# Altium project AttenController.PrjPcb
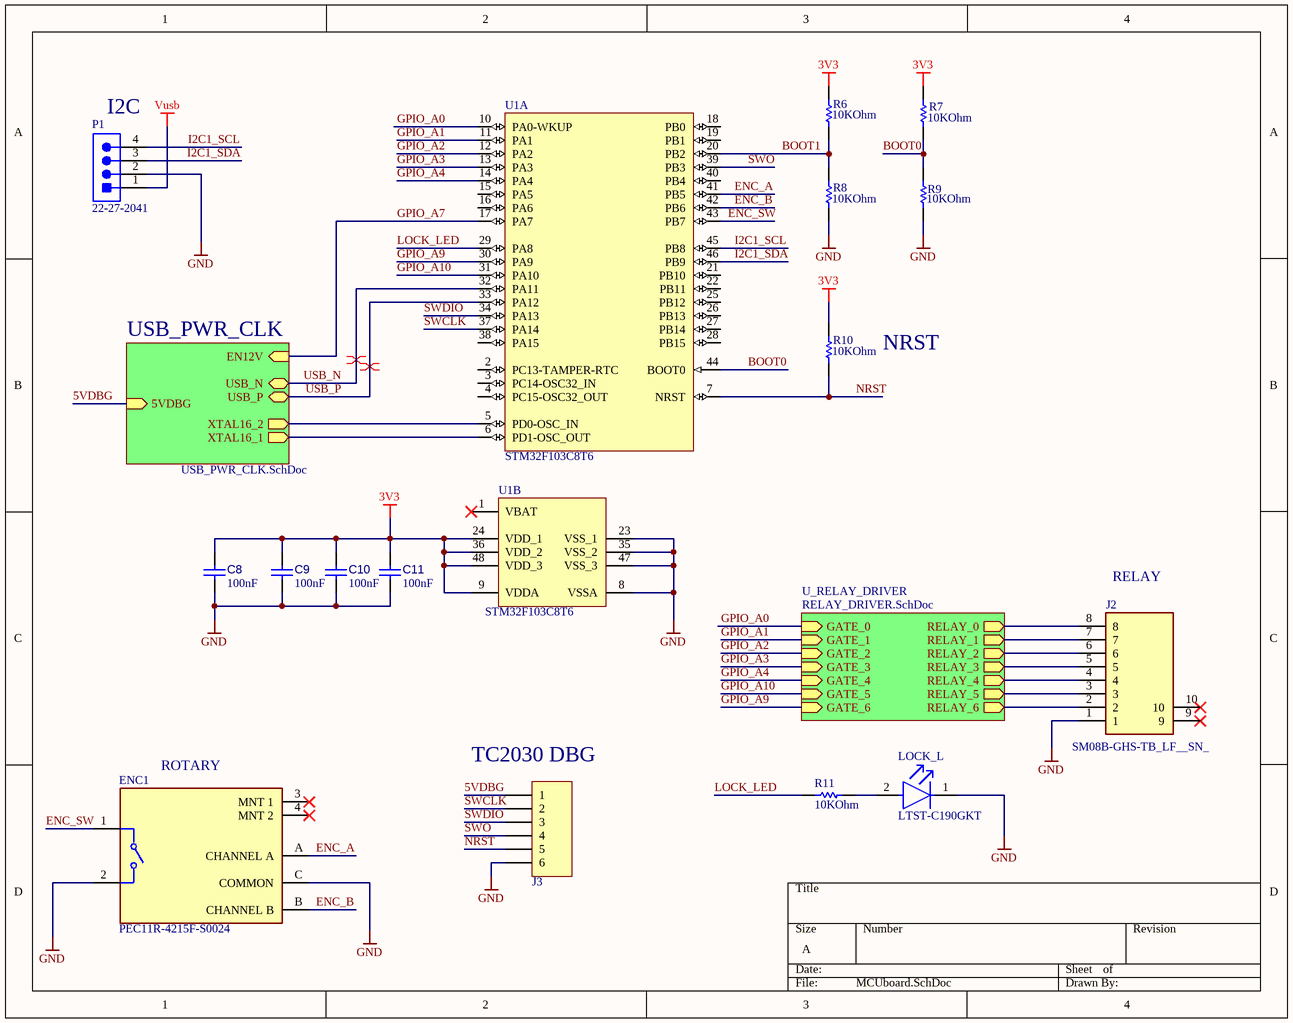
[diagram p0: MCUboard.SchDoc]
3 sheets, 63 parts. Net scope: hierarchical (ports join the sheet entries above them; power ports are global).
Board file: MCUboard.PcbDoc
Sheets:
  MCUboard.SchDoc
    USB_PWR_CLK = USB_PWR_CLK.SchDoc
    U_RELAY_DRIVER = RELAY_DRIVER.SchDoc

## Sheet MCUboard.SchDoc
size A; SheetNumber: 1; SheetTotal: 3

### Parts
C8  value 100nF  [CAPC1608X90X40NL10T20]  (hidden comment: Capacitor 100 nF +/-10% 50 V 0603)
C9  value 100nF  [CAPC1608X90X40NL10T20]  (hidden comment: Capacitor 100 nF +/-10% 50 V 0603)
C10  value 100nF  [CAPC1608X90X40NL10T20]  (hidden comment: Capacitor 100 nF +/-10% 50 V 0603)
C11  value 100nF  [CAPC1608X90X40NL10T20]  (hidden comment: Capacitor 100 nF +/-10% 50 V 0603)
ENC1  PEC11R-4215F-S0024  [FP-PEC11R-4215F-S0024-MFG]
J2  SM08B-GHS-TB_LF__SN_  [SM08BGHSTBLFSN]
J3  ICSP  [TC2030-MCP-NL]  (value not drawn)
LOCK_L  LTST-C190GKT  [FP-LTST-C190GKT-MFG]
P1  22-27-2041  [MOLX-22-27-2041_V]
R6  Resistance: 10KOhm  [RESC1609X55X30LL15T15]  (hidden comment: ERJ3EKF1002V)
R7  Resistance: 10KOhm  [RESC1609X55X30LL15T15]  (hidden comment: ERJ3EKF1002V)
R8  Resistance: 10KOhm  [RESC1609X55X30LL15T15]  (hidden comment: ERJ3EKF1002V)
R9  Resistance: 10KOhm  [RESC1609X55X30LL15T15]  (hidden comment: ERJ3EKF1002V)
R10  Resistance: 10KOhm  [RESC1609X55X30LL15T15]  (hidden comment: ERJ3EKF1002V)
R11  Resistance: 10KOhm  [RESC1609X55X30LL15T15]  (hidden comment: ERJ3EKF1002V)
U1  STM32F103C8T6  [STM-LQFP48_L]  (parts A,B of 2)

### Sub-sheets
U_RELAY_DRIVER = RELAY_DRIVER.SchDoc: GATE_0 (in), RELAY_0 (out), GATE_1 (in), RELAY_1 (out), GATE_2 (in), RELAY_2 (out), RELAY_3 (out), RELAY_4 (out), RELAY_5 (out), RELAY_6 (out), GATE_3 (in), GATE_4 (in), GATE_5 (in), GATE_6 (in)
USB_PWR_CLK = USB_PWR_CLK.SchDoc: XTAL16_2 (out), XTAL16_1 (out), USB_N (bidir), USB_P (bidir), EN12V (in), 5VDBG (in)

### Nets
3V3: C8.1 C9.1 C10.1 C11.1 R6.2 R7.2 R10.2 U1.9(VDDA) U1.24(VDD_1) U1.36(VDD_2) U1.48(VDD_3)
GND: C8.2 C9.2 C10.2 C11.2 ENC1.2 ENC1.C(COMMON) J2.1 J3.6 LOCK_L.1(C) P1.2 R8.1 R9.1 U1.8(VSSA) U1.23(VSS_1) U1.35(VSS_2) U1.47(VSS_3)
Vusb: P1.1
5VDBG: J3.1 ; sheet USB_PWR_CLK/5VDBG
BOOT0: R7.1 R9.2 U1.44(BOOT0)
BOOT1: R6.1 R8.2 U1.20(PB2)
ENC_A: ENC1.A(CHANNEL_A) U1.41(PB5)
ENC_B: ENC1.B(CHANNEL_B) U1.42(PB6)
ENC_SW: ENC1.1 U1.43(PB7)
GPIO_A0: U1.10(PA0-WKUP) ; sheet U_RELAY_DRIVER/GATE_0
GPIO_A1: U1.11(PA1) ; sheet U_RELAY_DRIVER/GATE_1
GPIO_A2: U1.12(PA2) ; sheet U_RELAY_DRIVER/GATE_2
GPIO_A3: U1.13(PA3) ; sheet U_RELAY_DRIVER/GATE_3
GPIO_A4: U1.14(PA4) ; sheet U_RELAY_DRIVER/GATE_4
GPIO_A7: U1.17(PA7) ; sheet USB_PWR_CLK/EN12V
GPIO_A9: U1.30(PA9) ; sheet U_RELAY_DRIVER/GATE_6
GPIO_A10: U1.31(PA10) ; sheet U_RELAY_DRIVER/GATE_5
I2C1_SCL: P1.4 U1.45(PB8)
I2C1_SDA: P1.3 U1.46(PB9)
LOCK_LED: R11.2 U1.29(PA8)
NRST: J3.5 R10.1 U1.7(NRST)
SWCLK: J3.2 U1.37(PA14)
SWDIO: J3.3 U1.34(PA13)
SWO: J3.4 U1.39(PB3)
USB_N: U1.32(PA11) ; sheet USB_PWR_CLK/USB_N
USB_P: U1.33(PA12) ; sheet USB_PWR_CLK/USB_P
NetC2_1: U1.5(PD0-OSC_IN) ; sheet USB_PWR_CLK/XTAL16_2
NetC3_1: U1.6(PD1-OSC_OUT) ; sheet USB_PWR_CLK/XTAL16_1
NetD2_2: J2.8 ; sheet U_RELAY_DRIVER/RELAY_0
NetD3_2: J2.7 ; sheet U_RELAY_DRIVER/RELAY_1
NetD4_2: J2.6 ; sheet U_RELAY_DRIVER/RELAY_2
NetD5_2: J2.5 ; sheet U_RELAY_DRIVER/RELAY_3
NetD6_2: J2.4 ; sheet U_RELAY_DRIVER/RELAY_4
NetD7_2: J2.3 ; sheet U_RELAY_DRIVER/RELAY_5
NetD8_2: J2.2 ; sheet U_RELAY_DRIVER/RELAY_6
NetLOCK_L_2: LOCK_L.2(A) R11.1

Not connected (* = marked no-connect by the designer): ENC1 3(MNT_1)* 4(MNT_2)*; J2 9* 10*; U1 1(VBAT)* 2(PC13-TAMPER-RTC) 3(PC14-OSC32_IN) 4(PC15-OSC32_OUT) 15(PA5) 16(PA6) 18(PB0) 19(PB1) 21(PB10) 22(PB11) 25(PB12) 26(PB13) 27(PB14) 28(PB15) 38(PA15) 40(PB4)

### Layout directives
differential pair; differential pair class USB: USB_N, USB_P

### Notes on the sheet
- (near P1) I2C
- NRST
- (near J2) RELAY
- (near ENC1) ROTARY
- (near J3) TC2030 DBG

### Library data of the parts
C8-C11 = CMP-001-00017-7: Chip Capacitor, 100 nF, +/- 10%, 50 V, 0603 (1608 Metric); Voltage Rating: 50V; Capacitor Type: Ceramic; Tolerance: 10%; Mounting Technology: SM; Max Operating Temperature: 125°C; RoHS Compliant: True; Pins: 2; Case/Package: 0603; Min Operating Temperature: -55°C
ENC1 = CMP-1747-00012-2: ROTARY ENCODER MECHANICAL 24PPR; Hole Diameter: 1.8mm; Output Type: Quadrature; Pulses per Revolution: 24; Number of Channels: 2; Built in Switch: Yes; Min Operating Temperature: -30°C; Series: PEC11R; Type: Mechanical; Package Quantity: 150; Length: 21.5mm; Max Operating Temperature: 70°C; Encoder Type: Mechanical; Height: 13.4mm; Detent: Yes; Packaging: Bulk; Orientation: Vertical; Width: 12.5mm; Termination: PC Pins; Mount: Through Hole; REACH SVHC: No SVHC; Radiation Hardening: No; RoHS Compliant: Yes
J2 = SM08B-GHS-TB_LF__SN_: Connector; Manufacturer_Name: JST (JAPAN SOLDERLESS TERMINALS); Manufacturer_Part_Number: SM08B-GHS-TB(LF)(SN); Datasheet Link: http://www.jst-mfg.com/product/pdf/eng/eGH.pdf; Height: 4.05mm; Arrow Part Number: SM08B-GHS-TB(LF)(SN); Arrow Price/Stock: https://www.arrow.com/en/products/sm08b-ghs-tb-lf-sn/jst-manufacturing
J3 = CMP-008-000000-2: Design Item ID: ICSP; Component Type: Standard; Source: TC2030.SchLib; Pin Count: 5
LOCK_L = CMP-22017-000005-2: LED GREEN CLEAR CHIP SMD; Dominant Wavelength: 569nm; Reverse Voltage: 5V; Lens Color: Colorless; Viewing Angle: 130°; Voltage: 2V; Forward Current: 30mA; Power Dissipation: 100mW; Luminous Intensity: 6mcd; Number of LEDs: 1; Forward Voltage: 2.1V; Wavelength: 565nm; Test Current: 10mA; Min Operating Temperature: -55°C; Lens Style: Clear; Mount: Surface Mount; Width: 0.8mm; Packaging: Tape and Reel; Lens Transparency: Clear; Case Code (Metric): 1608; Depth: 0.8mm; Case Code (Imperial): 0603; Case/Package: 0603; Number of Pins: 2; Max Operating Temperature: 85°C; Lead Free: Lead Free; Number of Elements: 1; Length: 1.6mm; Height: 0.8mm; Package Quantity: 1; Power Rating: 100mW; Radiation Hardening: No; Illumination Color: Green; Color: Green
P1 = CMP-2000-05243-1: Male Header, Pitch 2.54 mm, 1 x 4 Position, Height 11.7 mm, Tail Length 3.56 mm, RoHS, Bulk; Manufacturer: Molex; Voltage rating: 250V; Current rating: 4A; Datasheet Version: Rev. F, 06/2009; Operating temperature: 0degCto+75degC; Contact material: Tinplatedbrass; Manufacturer URL: http://www.molex.com/; Housing material: Nylon(UL94V-0); Datasheet URL: http://www.molex.com/pdm_docs/sd/022272041_sd.pdf
R6-R11 = CMP-1012-00623-3: Chip Resistor, 10 KOhm, +/- 1%, 0.1 W, -55 to 155 degC, 0603 (1608 Metric), RoHS, Tape and Reel; Manufacturer: Panasonic; Voltage Rating: 75V; Case\/Package: 0603; Power Rating: 100mW; Temperature Coefficient: 100ppm\/degreesC; Number of Pins: 2; Package Reference: 603; Depth: 0.8mm; Mount: SurfaceMount; Package Description: 2-Pin Surface Mount Device, Body 1.6 x 0.85 mm; Datasheet Version: 02/2017; Length: 1.6mm; Lead Free: LeadFree; Height: 0.45mm; Number of Terminations: 2; Max Power Dissipation: 100mW; Min Operating Temperature: -55degC; Datasheet URL: https://industrial.panasonic.com/cdbs/www-data/pdf/RDA0000/AOA0000C304.pdf; Termination: SMD/SMT; Case Code (Metric): 1608; Case Code (Imperial): 0603; Tolerance: 1%; Max Operating Temperature: 155degC; RoHSCompliant: true; Voltage Rating (DC): 75V; Radiation Hardening: No; Packaging: TapeandReel; Composition: ThickFilm; Mounting Technology: SurfaceMount; Manufacturer URL: http://www.panasonic.com/; Width: 0.031inch; REACH SVHC: NoSVHC; Contact Plating: Tin; Military Standard: Not; Package Quantity: 1
U1 = CMP-0237-00215-3: ARM Cortex-M3 32-bit MCU, 64 KB Flash, 20 KB Internal RAM, 37 I/Os, 48-pin LQFP, -40 to 85 degC, Tray; Supply Voltage(Vcc) min (V): 2; Internal RAM Size (kB): 20; FLASH Size (Prog) (kB): 64; A/D Converter: 2x12-bit (10 Channel); I/Os (High Current): 37; Operating Frequency(F) (Processor speed) (MHz): 72; Core: ARM Cortex-M3; ComponentLink3Description: Package Specification; Mounting Technology: Surface Mount; PartNumber: STM32F103C8T6; PackageReference: LQFP48; Packing: Tray; ComponentLink3URL: http://www.st.com/st-web-ui/static/active/en/resource/technical/document/datasheet/DM00058181.pdf; DatasheetVersion: Rev. 16; ComponentLink1URL: http://www.st.com/web/en/home.html; PackageVersion: Rev. 6, 06/2013; ComponentLink2URL: http://www.st.com/st-web-ui/static/active/en/resource/technical/document/datasheet/CD00161566.pdf; ComponentLink1Description: Manufacturer URL; ComponentLink2Description: Datasheet; PackageDescription: 48-Pin Low Profile Quad Flat Package, 7 x 7 mm Body, 0.5 mm Pitch

## Sheet USB_PWR_CLK.SchDoc
size A; SheetNumber: 2; SheetTotal: 3
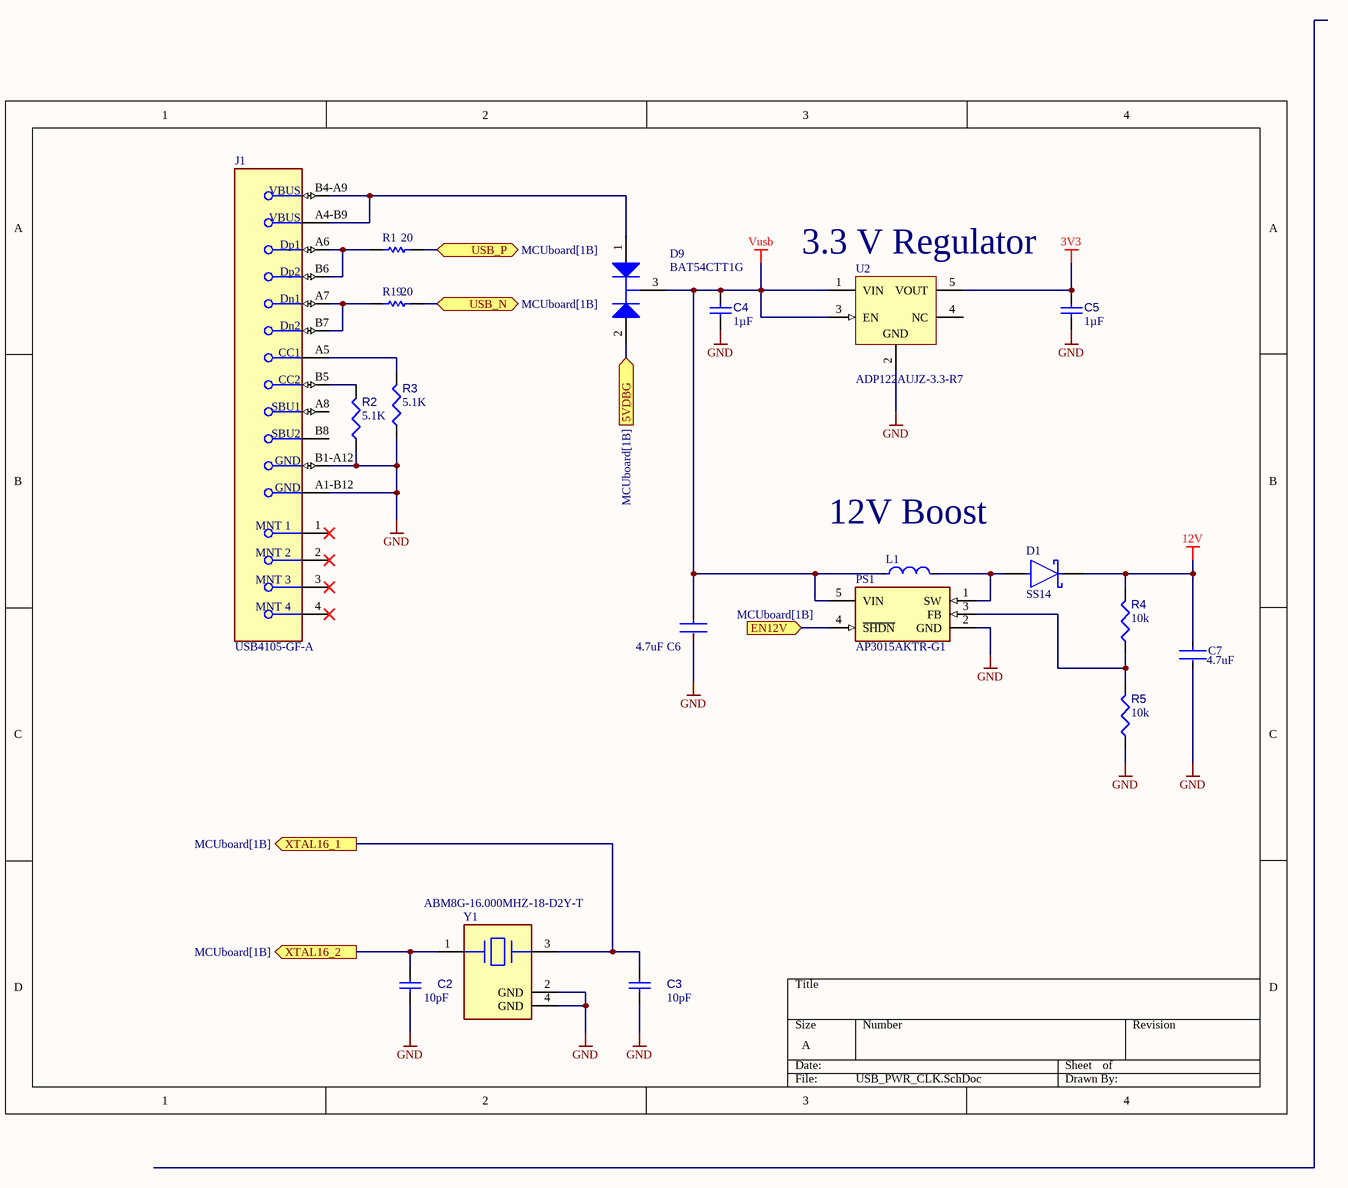
[diagram p1: USB_PWR_CLK.SchDoc]

### Parts
C2  value 10pF  [CAPC1608X87X35NL15T15]  (hidden comment: Capacitor 10 pF +/- 0.25 pF 50 V 0603)
C3  value 10pF  [CAPC1608X87X35NL15T15]  (hidden comment: Capacitor 10 pF +/- 0.25 pF 50 V 0603)
C4  value 1µF  [CAPC1608X90X35ML15T15]  (hidden comment: Capacitor 1uF +/- 10% 16V 0603)
C5  value 1µF  [CAPC1608X90X35ML15T15]  (hidden comment: Capacitor 1uF +/- 10% 16V 0603)
C6  Capacitance: 4.7uF  [FP-GRM188-0_15-IPC_C]  (hidden comment: GRM188R61E475KE11D)
C7  Capacitance: 4.7uF  [FP-GRM188-0_15-IPC_C]  (hidden comment: GRM188R61E475KE11D)
D1  SS14  [FP-403AE-MFG]
D9  BAT54CTT1G  [ONSC-SC-75-3-463-01_V]
J1  USB4105-GF-A  [FP-USB4105-GF-A-MFG]
L1  MLZ2012N100LT000  [FP-MLZ2012-1_25-MFG]  (value not drawn)
PS1  AP3015AKTR-G1  [SOT95P280X145-5N]
R1  Resistance: 20  [RESC1609X55X30LL15T15]  (hidden comment: ERJ3EKF1002V)
R2  value 5.1K  [RESC1608X55X25ML10T15]  (hidden comment: Resistor 10k +/-1% 0603 100 mW)
R3  value 5.1K  [RESC1608X55X25ML10T15]  (hidden comment: Resistor 10k +/-1% 0603 100 mW)
R4  value 10k  [RESC1608X55X25ML10T15]  (hidden comment: Resistor 10k +/-1% 0603 100 mW)
R5  value 10k  [RESC1608X55X25ML10T15]  (hidden comment: Resistor 10k +/-1% 0603 100 mW)
R19  Resistance: 20  [RESC1609X55X30LL15T15]  (hidden comment: ERJ3EKF1002V)
U2  ADP122AUJZ-3.3-R7  [ADI-UJ-5_M]
Y1  ABM8G-16.000MHZ-18-D2Y-T  [FP-ABM8G-MFG]

### Ports
5VDBG (in, see MCUboard[1B]), EN12V (in, see MCUboard[1B]), USB_N (bidir, see MCUboard[1B]), USB_P (bidir, see MCUboard[1B]), XTAL16_1 (out, see MCUboard[1B]), XTAL16_2 (out, see MCUboard[1B])

### Nets
3V3: C5.2 U2.5(VOUT)
12V: C7.1 D1.2(C) R4.2
GND: C2.2 C3.2 C4.1 C5.1 C6.2 C7.2 J1.A1-B12(GND) J1.B1-A12(GND) PS1.2(GND) R2.1 R3.1 R5.1 U2.2(GND) Y1.2(GND) Y1.4(GND)
Vusb: C4.2 C6.1 D9.3(K) L1.1 PS1.5(VIN) U2.1(VIN) U2.3(EN)
5VDBG: D9.2(A2) ; port 5VDBG
GPIO_A7: PS1.4(~{SHDN}) ; port EN12V
USB_N: R19.1 ; port USB_N
USB_P: R1.1 ; port USB_P
NetC2_1: C2.1 Y1.1 ; port XTAL16_2
NetC3_1: C3.1 Y1.3 ; port XTAL16_1
NetD1_1: D1.1(A) L1.2 PS1.1(SW)
NetD9_1: D9.1(A1) J1.A4-B9(VBUS) J1.B4-A9(VBUS)
NetJ1_A5: J1.A5(CC1) R3.2
NetJ1_A6: J1.A6(Dp1) J1.B6(Dp2) R1.2
NetJ1_A7: J1.A7(Dn1) J1.B7(Dn2) R19.2
NetJ1_B5: J1.B5(CC2) R2.2
NetPS1_3: PS1.3(FB) R4.1 R5.2

Not connected (* = marked no-connect by the designer): J1 1(MNT_1)* 2(MNT_2)* 3(MNT_3)* 4(MNT_4)* A8(SBU1) B8(SBU2); U2 4(NC)

### Notes on the sheet
- 3.3 V Regulator
- 12V Boost

### Library data of the parts
C2 C3 = CMP-001-00012-7: Chip Capacitor, 10 pF, +/- 0.25 pF, 50 V, 0603 (1608 Metric); Tolerance: 0.25%; Capacitor Type: Ceramic; Voltage Rating: 50V; Max Operating Temperature: 125°C; RoHS Compliant: True; Mounting Technology: SM; Pins: 2; Case/Package: 0603; Min Operating Temperature: -55°C
C4 C5 = CMP-001-00004-7: Chip Capacitor, 1 uF, +/- 10%, 16 V, 0603 (1608 Metric); Capacitor Type: Ceramic; Mounting Technology: SM; RoHS Compliant: True; Min Operating Temperature: -55°C; Case/Package: 0603; Pins: 2; Voltage Rating: 16V; Max Operating Temperature: 125°C; Tolerance: 10%
C6 C7 = CMP-2006-02523-2: Chip Multilayer Ceramic Capacitors for General Purpose, 0603, 4.7uF, X5R, 15%, 10%, 25V; Case Code (Metric): 1608; Max Operating Temperature: 85°C; REACH SVHC: No SVHC; Voltage Rating: 25V; Dielectric: X5R; Packaging: Cut Tape; Width: 0.031inch; Min Operating Temperature: -55°C; Lead Free: Lead Free; Height: 0.8mm; Case Code (Imperial): 0603; Length: 1.6mm; Voltage Rating (DC): 25V; Case/Package: 0603; Voltage: 25V; Tolerance: 10%; Thickness: 0.031inch; Mount: Surface Mount; Material: Ceramic; Package Quantity: 4000; Depth: 0.8mm
D1 = CMP-2000-04943-2: DIODE SCHOTTKY 40V 1A SMA; Manufacturer: ON Semiconductor; Peak Reverse Current: 0.2mA; Max Junction Temp: +125°C; Standoff Height: 0.05mm; Max Surge Forward Current: 40A; Mouser Description: Schottky Diodes & Rectifiers SMA 40V 1.0A; RoHS: TRUE; Lead Free: Yes; Manufacturer Part Number: SS14; Device Class L3: Schottky Diodes; Category: Diode; Automotive: No; Digikey Description: DIODE SCHOTTKY 40V 1A SMA; ComponentLink2Description: Datasheet; Device Class L2: Diodes; Height: 2.5mm; Temperature Range High: +125°C; ComponentLink2URL: https://www.onsemi.com/pub/Collateral/SS19-D.PDF; Device Class L1: Discrete Semiconductors; Package: 403AE; Octopart: https://octopart.com/ss14-on+semiconductor-29205033; Max Repetitive Reverse Voltage: 40V; Temperature Range Low: -65°C; Forward Current: 1A; Temperature: -65°C to +125°C
D9 = CMP-1055-00298-1: Dual Series Cathode Schottky Barrier Diodes, 3-Pin SC-75, Pb-Free, Tape and Reel; Manufacturer: On Semiconductor; trr Max (ns): 5; Configuration: Common Cathode; IFSM Max (A): 0.6; Packing: Tape and Reel; PackageReference: SC-75-3-463-01; PackageVersion: Rev. F, 07/2005; ComponentLink3URL: http://www.onsemi.com/pub_link/Collateral/463-01.PDF; ComponentLink1URL: http://www.onsemi.com/; RoHS: TRUE; ComponentLink2URL: http://www.onsemi.cn/pub_link/Collateral/BAT54CTT1-D.PDF; Mounting Technology: Surface Mount; PartNumber: BAT54CTT1G; DatasheetVersion: Rev. 4; PackageDescription: 3-Pin Small Outline Transistor, Body 1.6 x 0.8 mm, Pitch 0.5 mm; ComponentLink2Description: Datasheet; ComponentLink3Description: Package Specification; ComponentLink1Description: Manufacturer URL
J1 = CMP-002-00072-3: Conn USB 2.0 Type C RCP 24 POS 0.3mm/0.5mm Solder RA SMD 24 Terminal 1 Port T/R
L1 = CMP-08253-000052-1: Shielded Multilayer Inductor 10uH ±20% 500mA 390mΩ SMD 0805; Self Resonant Frequency: 50MHz; Core Material: Ferrite; Test Frequency: 2MHz; Saturation Current: 110mA; DC Resistance (DCR): 390mR; Current Rating: 500mA; Case Code (Metric): 2012; Package Quantity: 1; RoHS Compliant: Yes; Tolerance: 20%; Height - Seated (Max): 0.057inch; Case/Package: 0805; Width: 0.049inch; Mount: Surface Mount; Max Operating Temperature: 125°C; Inductance: 10uH; Packaging: Tape and Reel; Length: 0.079inch; Min Operating Temperature: -55°C; Case Code (Imperial): 0805; Shielding: Shielded
PS1 = AP3015AKTR-G1: Power Supply; Manufacturer_Name: Diodes Inc.; Datasheet Link: https://www.diodes.com/assets/Datasheets/AP3015_A.pdf; Height: 1.45mm; Manufacturer_Part_Number: AP3015AKTR-G1; Mouser Part Number: 621-AP3015AKTR-G1; Mouser Price/Stock: https://www.mouser.co.uk/ProductDetail/Diodes-Incorporated/AP3015AKTR-G1?qs=x6A8l6qLYDBKZpaE8%2FwCMQ%3D%3D; Arrow Part Number: AP3015AKTR-G1; Arrow Price/Stock: https://www.arrow.com/en/products/ap3015aktr-g1/diodes-incorporated?region=nac
R1 R19 = CMP-1012-00623-3: as R6 on sheet MCUboard; Number of Pins: 2; Package Reference: 603; Depth: 0.8mm; Mount: SurfaceMount; Package Description: 2-Pin Surface Mount Device, Body 1.6 x 0.85 mm; Datasheet Version: 02/2017; Length: 1.6mm; Lead Free: LeadFree; Height: 0.45mm; Number of Terminations: 2; Max Power Dissipation: 100mW; Min Operating Temperature: -55degC; Datasheet URL: https://industrial.panasonic.com/cdbs/www-data/pdf/RDA0000/AOA0000C304.pdf; Termination: SMD/SMT; Case Code (Metric): 1608; Case Code (Imperial): 0603; Tolerance: 1%; Max Operating Temperature: 155degC; RoHSCompliant: true; Voltage Rating (DC): 75V; Radiation Hardening: No; Packaging: TapeandReel; Composition: ThickFilm; Mounting Technology: SurfaceMount; Manufacturer URL: http://www.panasonic.com/; Width: 0.031inch; REACH SVHC: NoSVHC; Contact Plating: Tin; Military Standard: Not; Package Quantity: 1
R2-R5 = CMP-009-00017-5: Chip Resistor, 10 KOhm, +/- 1%, 01 W, -55 to 155 degC, 0603 (1608 Metric); Voltage Rating: 50V; Power: 100mW; RoHS Compliant: True; Min Operating Temperature: -55°C; Pins: 2; Case/Package: 0603; Mounting Technology: SM; Max Operating Temperature: 155°C; Tolerance: 1%
U2 = CMP-0786-00346-1: 300 mA, Low Quiescent Current, CMOS Linear Regulator, 2.3 to 5.5 V Vin, 3.3 V Vout, Industrial, 5-pin SOT23 (UJ-5), Reel; Manufacturer: Analog Devices; Vin (min) (V): 2.3; Supply Current IGND @ Small Load: 45uA; Vin (max) (V): 5.5; Iout max: 300mA; Preset Vout Values (V): 3.3; ComponentLink4Description: URL Link1; ComponentLink4URL: Product URL:http://www.analog.com/en/ADP122/productSearch.html; ComponentLink2URL: http://www.analog.com/static/imported-files/data_sheets/ADP122_123.pdf; PackageDescription: 5-Pin Thin Small Outline Transistor Package, Body 2.9 x 1.6 mm, Pitch 0.95 mm; ComponentLink1URL: http://www.analog.com/en/index.html; ComponentLink3URL: http:/www.analog.com/static/imported-files/packages/PKG_PDF/TSOT(UJ)/UJ_5.pdf; ComponentLink2Description: Datasheet; PartNumber: ADP122AUJZ-3.3-R7; Packing: Reel; ComponentLink1Description: Manufacturer URL; Code_JEDEC: MO-193-AB; PackageVersion: 100708-A, 10/2008; PackageReference: UJ-5; Mounting Technology: Surface Mount; DatasheetVersion: Rev. E; ComponentLink3Description: Package Specification
Y1 = CMP-27762-006537-2: Crystal 16MHz ±20ppm (Tol) ±30ppm (Stability) 18pF FUND 80Ω 4-Pin SMD T/R; Series Resistance: 80R; Radiation Hardening: No; Load Capacitance: 18pF; Package Quantity: 1000; Frequency Stability: 30ppm; ESR (Equivalent Series Resistance): 80R; Depth: 2.5mm; Height: 1mm; Number of Pins: 4; Frequency Tolerance: 20ppm; Frequency: 16MHz; Tolerance: 20ppm; Min Operating Temperature: -40°C; Length: 3.2mm; Termination: SMD/SMT; Max Operating Temperature: 85°C; Width: 2.5mm; Series: ABM8G; Mount: Surface Mount; Case/Package: CSMD; Lead Free: Lead Free; Operating Frequency: 16 MHz; Packaging: Tape and Reel

## Sheet RELAY_DRIVER.SchDoc
size A; SheetNumber: 3; SheetTotal: 3
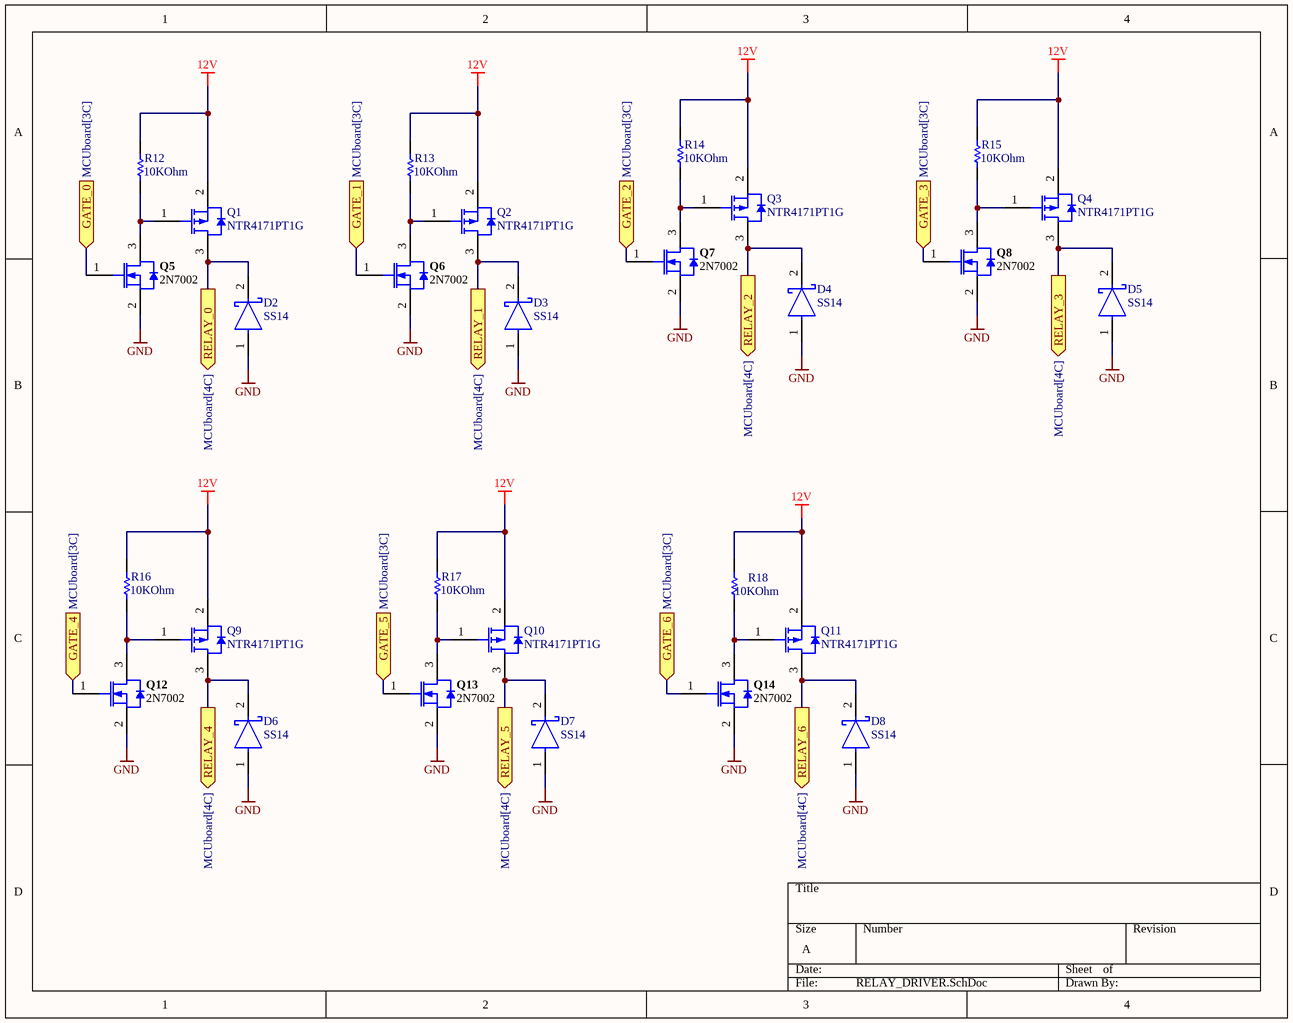
[diagram p2: RELAY_DRIVER.SchDoc]

### Parts
D2  SS14  [FP-403AE-MFG]
D3  SS14  [FP-403AE-MFG]
D4  SS14  [FP-403AE-MFG]
D5  SS14  [FP-403AE-MFG]
D6  SS14  [FP-403AE-MFG]
D7  SS14  [FP-403AE-MFG]
D8  SS14  [FP-403AE-MFG]
Q1  NTR4171PT1G  [ONSC-SOT-23-3-318-08_V]
Q2  NTR4171PT1G  [ONSC-SOT-23-3-318-08_V]
Q3  NTR4171PT1G  [ONSC-SOT-23-3-318-08_V]
Q4  NTR4171PT1G  [ONSC-SOT-23-3-318-08_V]
Q5  2N7002  [INF-PG-SOT23_M]
Q6  2N7002  [INF-PG-SOT23_M]
Q7  2N7002  [INF-PG-SOT23_M]
Q8  2N7002  [INF-PG-SOT23_M]
Q9  NTR4171PT1G  [ONSC-SOT-23-3-318-08_V]
Q10  NTR4171PT1G  [ONSC-SOT-23-3-318-08_V]
Q11  NTR4171PT1G  [ONSC-SOT-23-3-318-08_V]
Q12  2N7002  [INF-PG-SOT23_M]
Q13  2N7002  [INF-PG-SOT23_M]
Q14  2N7002  [INF-PG-SOT23_M]
R12  Resistance: 10KOhm  [RESC1609X55X30LL15T15]  (hidden comment: ERJ3EKF1002V)
R13  Resistance: 10KOhm  [RESC1609X55X30LL15T15]  (hidden comment: ERJ3EKF1002V)
R14  Resistance: 10KOhm  [RESC1609X55X30LL15T15]  (hidden comment: ERJ3EKF1002V)
R15  Resistance: 10KOhm  [RESC1609X55X30LL15T15]  (hidden comment: ERJ3EKF1002V)
R16  Resistance: 10KOhm  [RESC1609X55X30LL15T15]  (hidden comment: ERJ3EKF1002V)
R17  Resistance: 10KOhm  [RESC1609X55X30LL15T15]  (hidden comment: ERJ3EKF1002V)
R18  Resistance: 10KOhm  [RESC1609X55X30LL15T15]  (hidden comment: ERJ3EKF1002V)

### Ports
GATE_0 (in, see MCUboard[3C]), GATE_1 (in, see MCUboard[3C]), GATE_2 (in, see MCUboard[3C]), GATE_3 (in, see MCUboard[3C]), GATE_4 (in, see MCUboard[3C]), GATE_5 (in, see MCUboard[3C]), GATE_6 (in, see MCUboard[3C]), RELAY_0 (out, see MCUboard[4C]), RELAY_1 (out, see MCUboard[4C]), RELAY_2 (out, see MCUboard[4C]), RELAY_3 (out, see MCUboard[4C]), RELAY_4 (out, see MCUboard[4C]), RELAY_5 (out, see MCUboard[4C]), RELAY_6 (out, see MCUboard[4C])

### Nets
12V: Q1.2(S) Q2.2(S) Q3.2(S) Q4.2(S) Q9.2(S) Q10.2(S) Q11.2(S) R12.2 R13.2 R14.2 R15.2 R16.2 R17.2 R18.2
GND: D2.1(A) D3.1(A) D4.1(A) D5.1(A) D6.1(A) D7.1(A) D8.1(A) Q5.2(SOURCE) Q6.2(SOURCE) Q7.2(SOURCE) Q8.2(SOURCE) Q12.2(SOURCE) Q13.2(SOURCE) Q14.2(SOURCE)
GPIO_A0: Q5.1(GATE) ; port GATE_0
GPIO_A1: Q6.1(GATE) ; port GATE_1
GPIO_A2: Q7.1(GATE) ; port GATE_2
GPIO_A3: Q8.1(GATE) ; port GATE_3
GPIO_A4: Q12.1(GATE) ; port GATE_4
GPIO_A9: Q14.1(GATE) ; port GATE_6
GPIO_A10: Q13.1(GATE) ; port GATE_5
NetD2_2: D2.2(C) Q1.3(D) ; port RELAY_0
NetD3_2: D3.2(C) Q2.3(D) ; port RELAY_1
NetD4_2: D4.2(C) Q3.3(D) ; port RELAY_2
NetD5_2: D5.2(C) Q4.3(D) ; port RELAY_3
NetD6_2: D6.2(C) Q9.3(D) ; port RELAY_4
NetD7_2: D7.2(C) Q10.3(D) ; port RELAY_5
NetD8_2: D8.2(C) Q11.3(D) ; port RELAY_6
NetQ1_1: Q1.1(G) Q5.3(DRAIN) R12.1
NetQ2_1: Q2.1(G) Q6.3(DRAIN) R13.1
NetQ3_1: Q3.1(G) Q7.3(DRAIN) R14.1
NetQ4_1: Q4.1(G) Q8.3(DRAIN) R15.1
NetQ9_1: Q9.1(G) Q12.3(DRAIN) R16.1
NetQ10_1: Q10.1(G) Q13.3(DRAIN) R17.1
NetQ11_1: Q11.1(G) Q14.3(DRAIN) R18.1

### Library data of the parts
D2-D8 = CMP-2000-04943-2: as D1 on sheet USB_PWR_CLK; Mouser Description: Schottky Diodes & Rectifiers SMA 40V 1.0A; RoHS: TRUE; Lead Free: Yes; Manufacturer Part Number: SS14; Device Class L3: Schottky Diodes; Category: Diode; Automotive: No; Digikey Description: DIODE SCHOTTKY 40V 1A SMA; ComponentLink2Description: Datasheet; Device Class L2: Diodes; Height: 2.5mm; Temperature Range High: +125°C; ComponentLink2URL: https://www.onsemi.com/pub/Collateral/SS19-D.PDF; Device Class L1: Discrete Semiconductors; Package: 403AE; Octopart: https://octopart.com/ss14-on+semiconductor-29205033; Max Repetitive Reverse Voltage: 40V; Temperature Range Low: -65°C; Forward Current: 1A; Temperature: -65°C to +125°C
Q1-Q4 Q9-Q11 = CMP-1058-00738-1: Power MOSFET, -30 V, 3.5 A, Single P-Channel, 3-Pin SOT-23, Pb-Free, Tape and Reel; Manufacturer: On Semiconductor; VGS Max (V): 12; V(BR)DSS Min (V): 30; Crss Typ (pF): 65; VGS(th) Max (V): 1.4; Ciss Typ (pF): 720; Qrr Typ (nC): 8; Coss Typ (pF): 95; Channel Polarity: P Channel; ComponentLink2URL: http://www.onsemi.cn/pub_link/Collateral/NTR4171P-D.PDF; ComponentLink1Description: Manufacturer URL; PartNumber: NTR4171PT1G; Mounting Technology: Surface Mount; ComponentLink1URL: http://www.onsemi.com/; Packing: Tape and Reel; Package Type: SOT-23-3; ComponentLink2Description: Datasheet; PackageReference: SOT-23-3-318-08; Configuration: Single; ComponentLink3Description: Package Specification; DatasheetVersion: Rev. 1; PackageVersion: Rev. AP, 11/2009; RoHS: Pb-Free; PackageDescription: 3-Pin Small Outline Transistor, Body 2.92 x 1.3 mm, Pitch 0.95 mm; ComponentLink3URL: http://www.onsemi.cn/pub_link/Collateral/318-08.PDF
Q5-Q8 Q12-Q14 = CMP-1149-00026-1: N-Channel OptiMOS Small-Signal-Transistor, 60 V VDS, 0.3 A ID, -55 to 150 degC, PG-SOT23, Reel, Green; Manufacturer: Infineon; RDS (on) (max) (@4.5V): 4,000 mOhm; VDS (max): 60 V; IDpuls (max): 1.2Â A; QG: 0.4Â nC; RDS (on) (max): 3,000 mOhm; RthJA (max): 250 K/W; ID (max): 0.3Â A; VGS(th) (max): 2.5Â V; VGS(th) (min): 1.5Â V; Green: TRUE; Ptot (max): 0.5Â W; PackageDescription: 3-Pin Small Outline Transistor Package, 2.9 x 1.3 mm Body, 0.95 mm Pitch; Halogen-free: TRUE; ComponentLink2Description: Datasheet; ComponentLink1URL: http://www.infineon.com/; Packing: Reel; DatasheetVersion: Rev. 2.4; PartNumber: 2N7002; PackageReference: PG-SOT23; PackageVersion: Apr-08; ComponentLink3URL: http://www.infineon.com/dgdl/SOT23-Package_Overview.pdf?folderId=db3a30431936bc4b0119532290053c66&fileId=db3a30431936bc4b0119533468123c85; ComponentLink1Description: Manufacturer URL; Mounting Technology: Surface Mount; ComponentLink3Description: Package Specification; ComponentLink2URL: http://www.infineon.com/dgdl/2N7002_Rev2.4.pdf?folderId=db3a3043156fd573011622e10b5c1f67&fileId=db3a304319bc939a0119c2a9461e79e6
R12-R18 = CMP-1012-00623-3: as R6 on sheet MCUboard; Number of Pins: 2; Package Reference: 603; Depth: 0.8mm; Mount: SurfaceMount; Package Description: 2-Pin Surface Mount Device, Body 1.6 x 0.85 mm; Datasheet Version: 02/2017; Length: 1.6mm; Lead Free: LeadFree; Height: 0.45mm; Number of Terminations: 2; Max Power Dissipation: 100mW; Min Operating Temperature: -55degC; Datasheet URL: https://industrial.panasonic.com/cdbs/www-data/pdf/RDA0000/AOA0000C304.pdf; Termination: SMD/SMT; Case Code (Metric): 1608; Case Code (Imperial): 0603; Tolerance: 1%; Max Operating Temperature: 155degC; RoHSCompliant: true; Voltage Rating (DC): 75V; Radiation Hardening: No; Packaging: TapeandReel; Composition: ThickFilm; Mounting Technology: SurfaceMount; Manufacturer URL: http://www.panasonic.com/; Width: 0.031inch; REACH SVHC: NoSVHC; Contact Plating: Tin; Military Standard: Not; Package Quantity: 1

## Nets that join several sheets
3V3: MCUboard (11 pins), USB_PWR_CLK (C5.2 U2.5)
12V: USB_PWR_CLK (C7.1 D1.2 R4.2), RELAY_DRIVER (14 pins)
GND: MCUboard (16 pins), USB_PWR_CLK (15 pins), RELAY_DRIVER (14 pins)
Vusb: MCUboard (P1.1), USB_PWR_CLK (7 pins)
5VDBG: MCUboard (J3.1), USB_PWR_CLK (D9.2)
GPIO_A0: MCUboard (U1.10), RELAY_DRIVER (Q5.1)
GPIO_A1: MCUboard (U1.11), RELAY_DRIVER (Q6.1)
GPIO_A2: MCUboard (U1.12), RELAY_DRIVER (Q7.1)
GPIO_A3: MCUboard (U1.13), RELAY_DRIVER (Q8.1)
GPIO_A4: MCUboard (U1.14), RELAY_DRIVER (Q12.1)
GPIO_A7: MCUboard (U1.17), USB_PWR_CLK (PS1.4)
GPIO_A9: MCUboard (U1.30), RELAY_DRIVER (Q14.1)
GPIO_A10: MCUboard (U1.31), RELAY_DRIVER (Q13.1)
NetC2_1: MCUboard (U1.5), USB_PWR_CLK (C2.1 Y1.1)
NetC3_1: MCUboard (U1.6), USB_PWR_CLK (C3.1 Y1.3)
NetD2_2: MCUboard (J2.8), RELAY_DRIVER (D2.2 Q1.3)
NetD3_2: MCUboard (J2.7), RELAY_DRIVER (D3.2 Q2.3)
NetD4_2: MCUboard (J2.6), RELAY_DRIVER (D4.2 Q3.3)
NetD5_2: MCUboard (J2.5), RELAY_DRIVER (D5.2 Q4.3)
NetD6_2: MCUboard (J2.4), RELAY_DRIVER (D6.2 Q9.3)
NetD7_2: MCUboard (J2.3), RELAY_DRIVER (D7.2 Q10.3)
NetD8_2: MCUboard (J2.2), RELAY_DRIVER (D8.2 Q11.3)
USB_N: MCUboard (U1.32), USB_PWR_CLK (R19.1)
USB_P: MCUboard (U1.33), USB_PWR_CLK (R1.1)